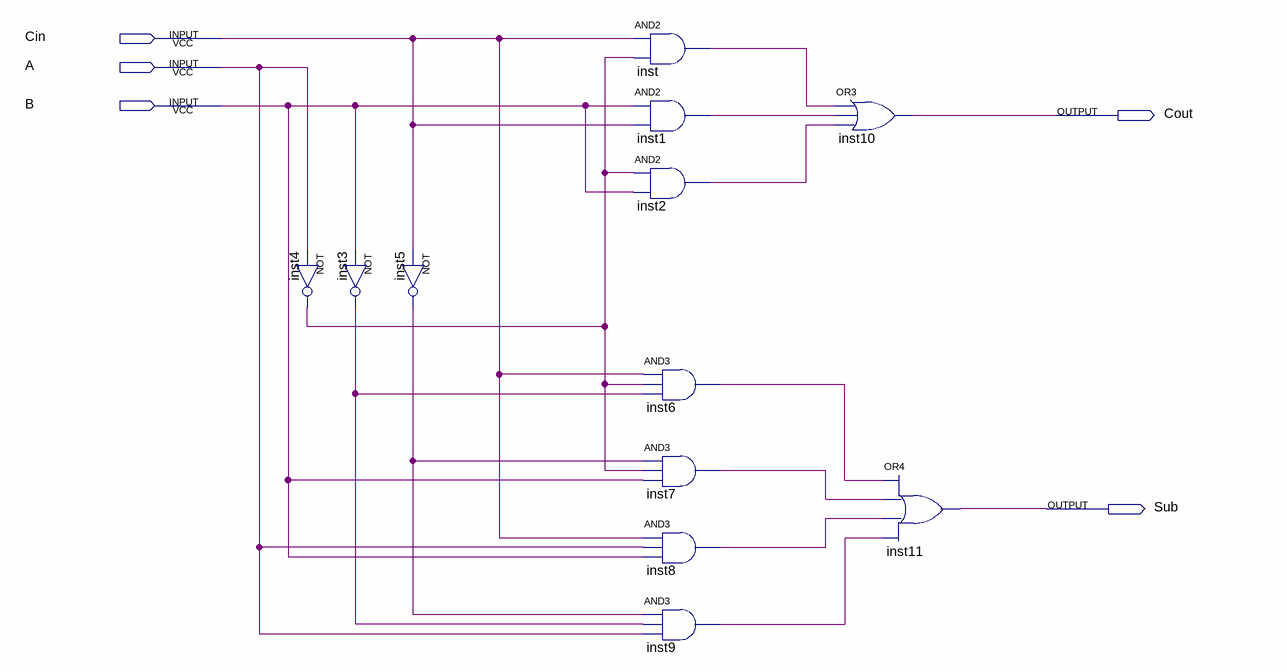
[diagram p0: schematic sheet]
// Quartus schematic full_sub.bdf as structural Verilog: 12 symbols, 5 pins
module full_sub (
  input  Cin,
  input  A,
  input  B,
  output Cout,
  output Sub
);

  wire inst1_out, inst2_out, inst3_out, inst4_out, inst5_out, inst6_out, inst7_out, inst8_out, inst9_out,
       inst_out;

  not inst4 (inst4_out, A);
  not inst3 (inst3_out, B);
  not inst5 (inst5_out, Cin);
  and inst (inst_out, Cin, inst4_out);
  and inst1 (inst1_out, B, Cin);
  and inst2 (inst2_out, inst4_out, B);
  and inst6 (inst6_out, Cin, inst4_out, inst3_out);
  and inst7 (inst7_out, inst5_out, inst4_out, B);
  and inst8 (inst8_out, Cin, A, B);
  and inst9 (inst9_out, inst5_out, inst3_out, A);
  or inst10 (Cout, inst_out, inst1_out, inst2_out);
  or inst11 (Sub, inst6_out, inst7_out, inst8_out, inst9_out);
endmodule
